# Altium project HDDA_encoder_revA01.PrjPcb
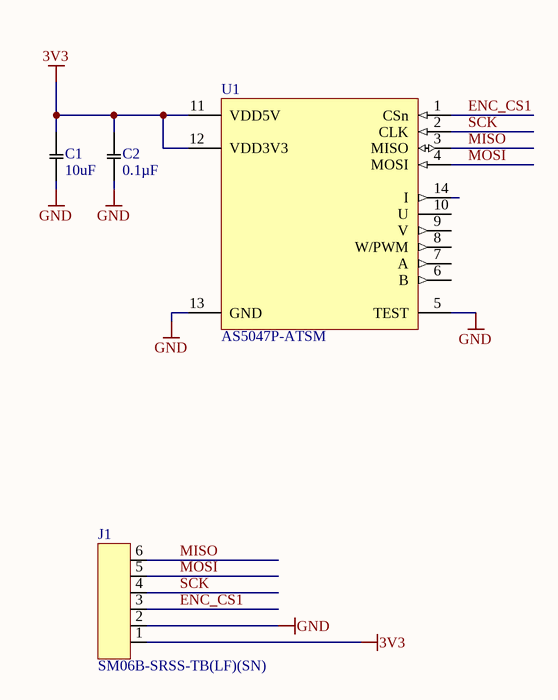
[diagram p0: HDDA_encoder.SchDoc]
board_revision: rev A01; part_number: PE-XXXX-01
1 sheet, 4 parts. Net scope: global (net labels, ports and power ports of the same name join across sheets).
Board file: HDDA_encoder.PcbDoc

## Sheet HDDA_encoder.SchDoc
size Tabloid; Organization: CMU Robotics Institute; Address1: Suite 780; Address2: 5001 Baum Blvd; Address3: Pittsburgh, PA 15213; Address4: USA

### Parts
C1  10uF  [C0603]
C2  0.1µF  [C0402]
J1  SM06B-SRSS-TB(LF)(SN)  [SM06B-SRSS-TB]
U1  AS5047P-ATSM  [AS5047X]

### Nets
3V3: C1.1 C2.1 J1.1 U1.11(VDD5V) U1.12(VDD3V3)
GND: C1.2 C2.2 J1.2 U1.5(TEST) U1.13(GND)
ENC_CS1: J1.3 U1.1(CSn)
MISO: J1.6 U1.3(MISO)
MOSI: J1.5 U1.4(MOSI)
SCK: J1.4 U1.2(CLK)

Not connected (* = marked no-connect by the designer): U1 6(B) 7(A) 8(W/PWM) 9(V) 10(U) 14(I)

### Notes on the sheet
- Title
- Size:
- Date:
- Tabloid
- Number:
- Time:
- Revision:
- Sheet
- of
- File:

### Library data of the parts
C1 = C1608X5R1A106K080AC: CAP CER 10UF 10V 10% X5R 0603; Manufacturer: TDK Corporation; Value: 10uF; Supplier 1: Digi-Key; Supplier Part Number 1: 445-7486-1-ND; ComponentLink1URL: http://www.tdk.com/pdf/TDKMLCCCapRange.pdf; ComponentLink1Description: Datasheet; Manufacturer Part Number: C1608X5R1A106K080AC; Lead Free Status / RoHS Status: Lead free / RoHS Compliant; Category: Capacitors; Tolerance: ±10%; Voltage - Rated: 10V; Temperature Coefficient: X5R; Mounting Type: Surface Mount, MLCC; Operating Temperature: -55°C ~ 85°C; Applications: General Purpose; Package / Case: 0603 (1608 Metric); Size / Dimension: 0.063" L x 0.031" W (1.60mm x 0.80mm); Thickness (Max): 0.035" (0.90mm)
C2 = C1005X7R1H104K050BB: CAP CER 0.1UF 50V 10% X7R 0402; Manufacturer: TDK Corporation; Value: 0.1µF; Supplier 1: Digi-Key; Supplier Part Number 1: 445-5932-1-ND; Manufacturer Part Number: C1005X7R1H104K050BB; ComponentLink1Description: Datasheet; ComponentLink1URL: http://product.tdk.com/en/catalog/datasheets/mlcc_commercial_general_en.pdf; Lead Free Status / RoHS Status: RoHS Compliant; Category: Capacitors; Tolerance: ±10%; Voltage - Rated: 50V; Temperature Coefficient: X7R; Mounting Type: Surface Mount, MLCC; Operating Temperature: -55°C ~ 125°C; Applications: General Purpose; Ratings: -; Package / Case: 0402 (1005 Metric); Size / Dimension: 0.039" L x 0.020" W (1.00mm x 0.50mm); Height - Seated (Max): -; Thickness (Max): 0.022" (0.55mm); Lead Spacing: -; Features: -; Lead Style: -
J1 = SM06B-SRSS-TB(LF)(SN): CONN HEADER SH 6POS SIDE 1MM TIN; Manufacturer: JST Sales America Inc; Connector Type: Header, Shrouded; Number of Positions: 6; Number of Positions Loaded: All; Pitch: 0.039" (1.00mm); Manufacturer Part Number: SM06B-SRSS-TB(LF)(SN); Supplier 1: Digi-Key; Supplier Part Number 1: 455-1806-1-ND; Lead Free Status / RoHS Status: RoHS Compliant; ComponentLink1Description: Datasheet; ComponentLink1URL: http://www.jst-mfg.com/product/pdf/eng/eSH.pdf; Category: Connectors, Interconnects; Contact Type: Male Pin; Number of Rows: 1; Row Spacing: -; Contact Mating Length: -; Mounting Type: Surface Mount, Right Angle; Termination: Solder; Fastening Type: -; Features: Solder Retention; Contact Finish: Tin; Contact Finish Thickness: -; Color: Natural
U1 = AS5047P-ATSM: IC ENCODER ROTARY 14TSSOP; Manufacturer: ams; Sensing Range: 35mT ~ 70mT; Voltage - Supply: 4.5 V ~ 5.5 V; Current - Supply: 15mA; Current - Output (Max): 4mA; Output Type: SPI; Manufacturer Part Number: AS5047P-ATSM; Supplier 1: Digi-Key; Supplier Part Number 1: AS5047P-ATSMCT-ND; Lead Free Status / RoHS Status: RoHS Compliant; ComponentLink1Description: Datasheet; ComponentLink1URL: http://ams.com/eng/content/download/725051/1853902/379375; Category: Sensors, Transducers; Type: Rotary; Features: SPI digital interface; Operating Temperature: -40°C ~ 125°C; Package / Case: 14-TSSOP (0.173", 4.40mm Width); Supplier Device Package: 14-TSSOP